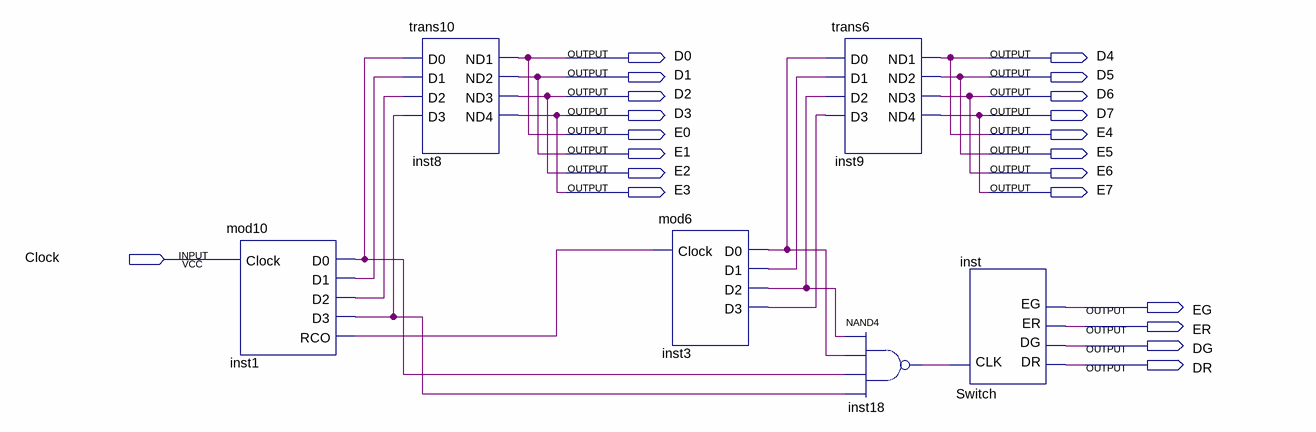
[diagram p0: schematic sheet]
// Quartus schematic Countdown.bdf as structural Verilog: 6 symbols, 21 pins
module Countdown (
  input  Clock,
  output D0,
  output D4,
  output D1,
  output D5,
  output D2,
  output D6,
  output D3,
  output D7,
  output E0,
  output E4,
  output E1,
  output E5,
  output E2,
  output E6,
  output E3,
  output E7,
  output EG,
  output ER,
  output DG,
  output DR
);

  wire inst1_d0, inst1_d1, inst1_d2, inst1_d3, inst1_rco, inst3_d0, inst3_d1, inst3_d2, inst3_d3, inst18_out;

  mod10 inst1 (.Clock(Clock), .D0(inst1_d0), .D1(inst1_d1), .D2(inst1_d2), .D3(inst1_d3), .RCO(inst1_rco));
  trans10 inst8 (.D0(inst1_d0), .D1(inst1_d1), .D2(inst1_d2), .D3(inst1_d3), .ND1(D0), .ND2(D1), .ND3(D2), .ND4(D3));
  mod6 inst3 (.Clock(inst1_rco), .D0(inst3_d0), .D1(inst3_d1), .D2(inst3_d2), .D3(inst3_d3));
  trans6 inst9 (.D0(inst3_d0), .D1(inst3_d1), .D2(inst3_d2), .D3(inst3_d3), .ND1(D4), .ND2(D5), .ND3(D6), .ND4(D7));
  nand inst18 (inst18_out, inst3_d2, inst3_d0, inst1_d0, inst1_d3);
  Switch inst (.CLK(inst18_out), .DR(DR), .DG(DG), .ER(ER), .EG(EG));

  assign E0 = D0;
  assign E1 = D1;
  assign E2 = D2;
  assign E3 = D3;
  assign E4 = D4;
  assign E5 = D5;
  assign E6 = D6;
  assign E7 = D7;
endmodule
